# EAGLE design MUX (EAGLE 6.5.0)
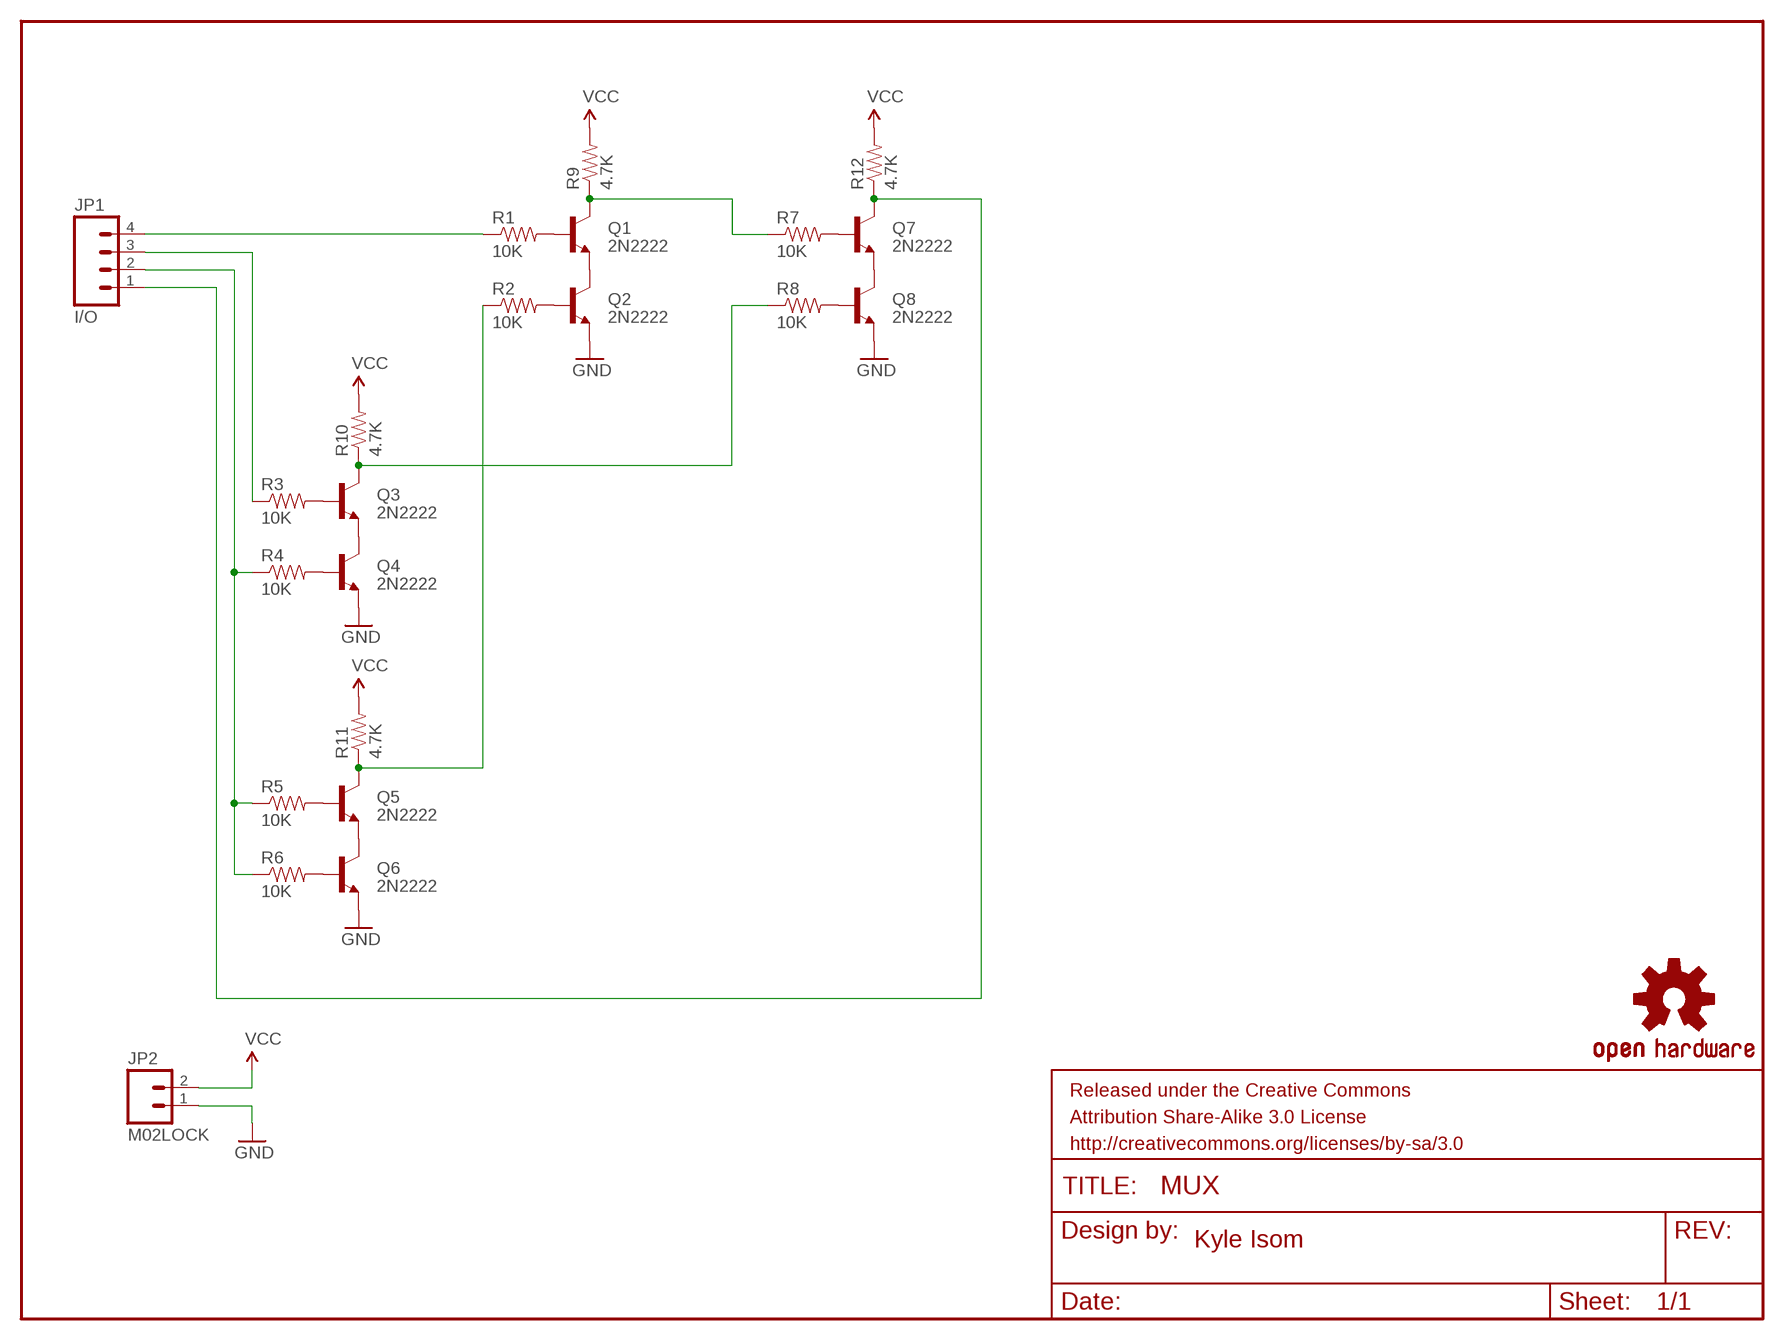
[diagram p0: schematic, sheet 1]

## Parts
FRAME1  FRAME-LETTER  [CREATIVE_COMMONS]
JP1  I/O  M04LOCK  [1X04_LOCK]
JP2  M02LOCK  [1X02_LOCK]
LOGO1  OSHW-LOGOS  [OSHW-LOGO-S]
Q1  2N2222  TRANSISTOR_NPNTO-92-AMMO  [TO-92-AMMO]
Q2  2N2222  TRANSISTOR_NPNTO-92-AMMO  [TO-92-AMMO]
Q3  2N2222  TRANSISTOR_NPNTO-92-AMMO  [TO-92-AMMO]
Q4  2N2222  TRANSISTOR_NPNTO-92-AMMO  [TO-92-AMMO]
Q5  2N2222  TRANSISTOR_NPNTO-92-AMMO  [TO-92-AMMO]
Q6  2N2222  TRANSISTOR_NPNTO-92-AMMO  [TO-92-AMMO]
Q7  2N2222  TRANSISTOR_NPNTO-92-AMMO  [TO-92-AMMO]
Q8  2N2222  TRANSISTOR_NPNTO-92-AMMO  [TO-92-AMMO]
R1  10K  RESISTORPTH-1/4W  [AXIAL-0.4]
R2  10K  RESISTORPTH-1/4W  [AXIAL-0.4]
R3  10K  RESISTORPTH-1/4W  [AXIAL-0.4]
R4  10K  RESISTORPTH-1/4W  [AXIAL-0.4]
R5  10K  RESISTORPTH-1/4W  [AXIAL-0.4]
R6  10K  RESISTORPTH-1/4W  [AXIAL-0.4]
R7  10K  RESISTORPTH-1/4W  [AXIAL-0.4]
R8  10K  RESISTORPTH-1/4W  [AXIAL-0.4]
R9  4.7K  RESISTORPTH-1/4W  [AXIAL-0.4]
R10  4.7K  RESISTORPTH-1/4W  [AXIAL-0.4]
R11  4.7K  RESISTORPTH-1/4W  [AXIAL-0.4]
R12  4.7K  RESISTORPTH-1/4W  [AXIAL-0.4]

## Nets
GND: JP2.1 Q2.1(E) Q4.1(E) Q6.1(E) Q8.1(E)
N$1: Q1.1(E) Q2.3(C)
N$2: Q3.1(E) Q4.3(C)
N$3: Q5.1(E) Q6.3(C)
N$4: Q1.2(B) R1.P$2
N$5: Q2.2(B) R2.P$2
N$6: Q3.2(B) R3.P$2
N$7: Q4.2(B) R4.P$2
N$8: Q5.2(B) R5.P$2
N$9: Q6.2(B) R6.P$2
N$10: Q7.1(E) Q8.3(C)
N$11: Q7.2(B) R7.P$2
N$12: Q8.2(B) R8.P$2
N$13: Q1.3(C) R7.P$1 R9.P$1
N$14: Q3.3(C) R8.P$1 R10.P$1
N$15: Q5.3(C) R2.P$1 R11.P$1
N$16: JP1.1 Q7.3(C) R12.P$1
N$17: JP1.4 R1.P$1
N$18: JP1.3 R3.P$1
N$19: JP1.2 R4.P$1 R5.P$1 R6.P$1
VCC: JP2.2 R9.P$2 R10.P$2 R11.P$2 R12.P$2

## Notes on the sheet
- Kyle Isom

## Library data of the parts
FRAME1 = SparkFun-Aesthetics:FRAME-LETTER: Schematic Frame Standard 8.5x11 US Letter frame
JP1 = SparkFun-Connectors:M04: Header 4 Standard 4-pin 0.1" header. Use with straight break away headers (SKU : PRT-00116), right angle break away headers (PRT-00553), swiss pins (PRT-00743), machine pins (PRT-00117), and female headers (PRT-00115). Molex polarized connector foot print use with SKU : PRT-08231 with associated crimp pins and housings. 1MM SMD Version SKU: PRT-10208
JP2 = SparkFun-Connectors:M02: Standard 2-pin 0.1" header. Use with - straight break away headers ( PRT-00116) - right angle break away headers (PRT-00553) - swiss pins (PRT-00743) - machine pins (PRT-00117) - female headers (PRT-00115) Molex polarized connector foot print use with: PRT-08233 with associated crimp pins and housings. 2.54_SCREWTERM for use with PRT-10571. 3.5mm Screw Terminal footprints for PRT-08084 5mm Screw Terminal footprints for use with PRT-08433
LOGO1 = SparkFun-Aesthetics:OSHW-LOGO: Open Source Hardware Logo This logo indicates the piece of hardware it is found on incorporates a OSHW license and/or adheres to the definition of open source hardware found here: http://freedomdefined.org/OSHW
Q1-Q8 = SparkFun-DiscreteSemi:TRANSISTOR_NPN: Generic NPN BJT MMBT2222A - TRANS-08049 (SOT-23, 1A 40V) MPSA42 - TRANS-09116 (SOT-23, 500mA 300V) MMBT5088LT1G - TRANS-11160 (SOT-23, 50 mA 30V)
R1-R12 = SparkFun-Passives:RESISTOR: Resistor Basic schematic elements and footprints for 0603, 1206, and PTH resistors.

## Board
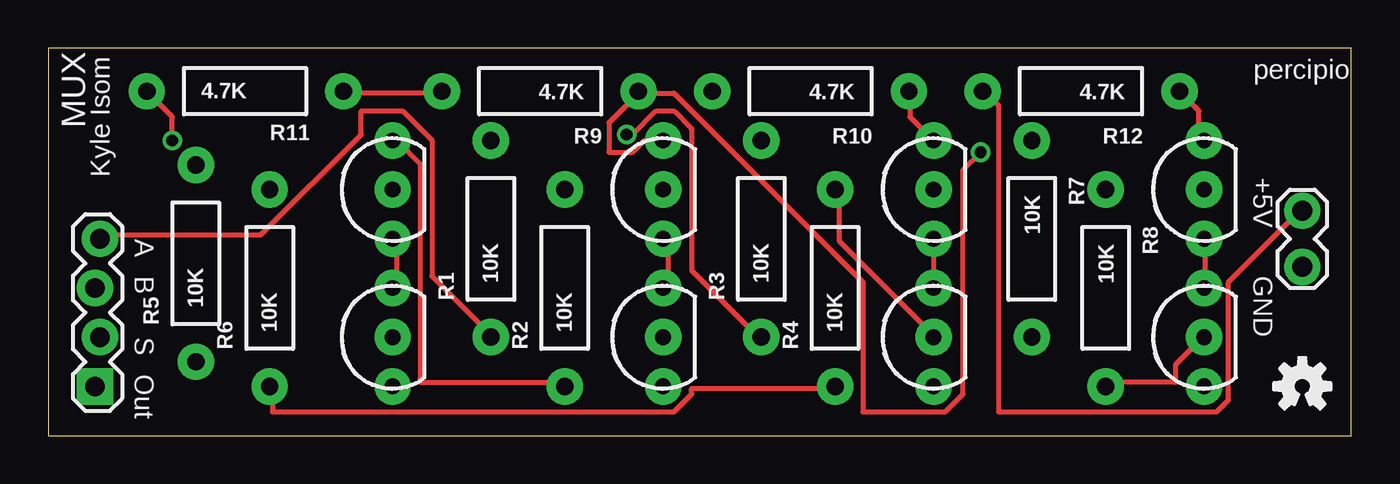
[diagram p1: board, top side]
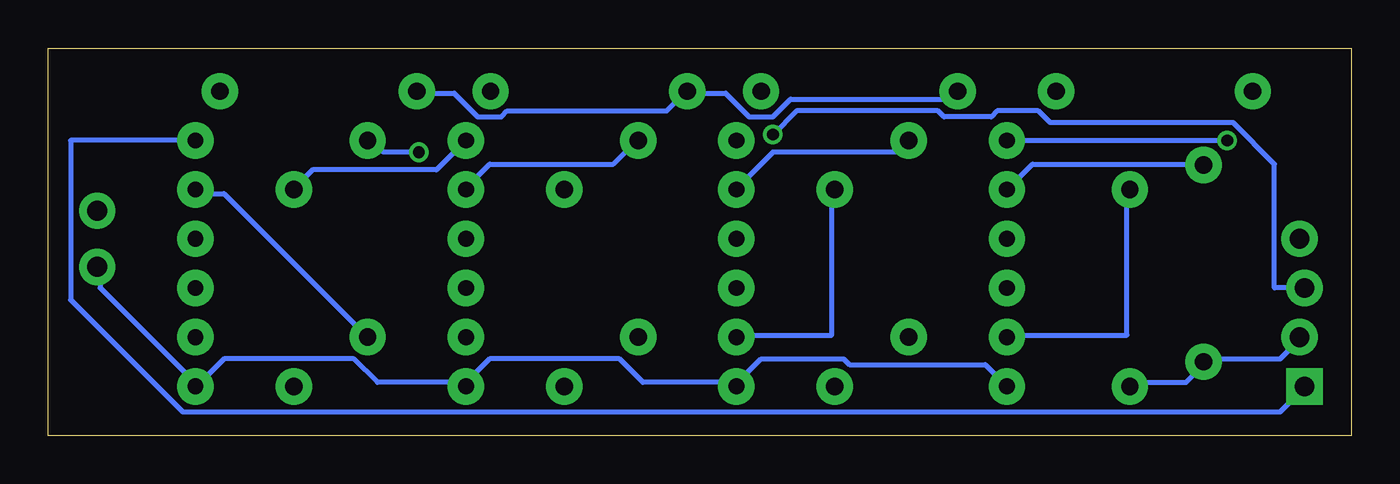
[diagram p2: board, bottom side, seen from below]

Size 67.29 x 19.99 mm. Coordinates in mm from the lower left corner, seen from the top.
Outline: 0,0 67.29,0 67.29,19.99 0,19.99 0,0
Copper layers (1*16): Top 0.035mm / dielectric 1.5mm / Bottom 0.035mm
Design rules "default": minimum track width 10mil, minimum drill 24mil, track to track 8mil, track to pad 8mil, pad to pad 8mil, via to via 8mil, smd to smd 8mil, copper to edge 40mil, drill to drill 8mil, minimum pad ring 10mil, minimum via ring 8mil, stop-mask expansion 4mil, vias tented up to drill 0mil, thermal gap 10mil

### Footprints (pad centres in the part's own frame; a part is rotated, then mirrored left to right if it is on the bottom)
1X04_LOCK = drill 1.016 pad 1.88 square: 1 0,0.127 | drill 1.016 pad 1.88: 2 2.54,-0.127; 3 5.08,0.127; 4 7.62,-0.127
1X02_LOCK = drill 1.016 pad 1.88: 1 -0.178,0; 2 2.718,0
TO-92-AMMO = drill 0.813 pad 1.88: 1 -2.54,0; 2 0,0; 3 2.54,0
AXIAL-0.4 = drill 0.9 pad 1.88: P$1 -5.08,0; P$2 5.08,0

### Placement (x,y rotation side)
FRAME1  11.43,-8.89 0 top  (outside the outline)
JP1  2.54,2.54 90 top
JP2  64.77,8.89 90 top
LOGO1  64.77,2.54 0 top
Q1  31.75,12.7 90 top
Q2  31.75,5.08 90 top
Q3  45.72,12.7 90 top
Q4  45.72,5.08 90 top
Q5  17.78,12.7 90 top
Q6  17.78,5.08 90 top
Q7  59.69,12.7 90 top
Q8  59.69,5.08 90 top
R1  22.86,10.16 90 top
R2  26.67,7.62 90 top
R3  36.83,10.16 90 top
R4  40.64,7.62 90 top
R5  7.62,8.89 90 top
R6  11.43,7.62 90 top
R7  50.8,10.16 270 top
R8  54.61,7.62 270 top
R9  25.4,17.78 180 top
R10  39.37,17.78 180 top
R11  10.16,17.78 0 top
R12  53.34,17.78 180 top

### Tracks (layer width: path | path; a pad name or v marks a point on that pad's centre or on a via)
GND
  Bottom 0.254: JP2.1 64.62,8.53 64.62,7.62 59.74,2.74 Q8.1 59.44,2.74 58.22,3.96 51.51,3.96 50.29,2.74 45.72,2.74 | Q6.1 18.9,3.66 25.91,3.66 26.21,3.96 30.48,3.96 31.7,2.74 Q2.1 32,2.74 36.58,2.74 37.8,3.96 44.5,3.96 45.72,2.74 | 45.72,2.74 Q4.1
N$1
  Top 0.254: Q2.3 32,7.62 32,10.06 Q1.1
N$2
  Top 0.254: Q3.1 Q4.3
N$3
  Top 0.254: Q6.3 17.98,7.62 17.98,10.06 Q5.1
N$4
  Bottom 0.254: R1.P$2 23.47,14.63 29.87,14.63 31.7,12.8 Q1.2
N$5
  Bottom 0.254: R2.P$2 26.82,12.5 26.82,5.18 31.7,5.18 Q2.2
N$6
  Bottom 0.254: R3.P$2 36.88,15.24 38.1,14.02 44.5,14.02 45.72,12.8 Q3.2
N$7
  Top 0.254: Q4.2 45.72,5.18 40.84,10.06 40.84,12.5 R4.P$2
N$8
  Bottom 0.254: Q5.2 16.46,14.02 7.62,14.02 R5.P$2
N$9
  Bottom 0.254: R6.P$2 11.58,12.5 11.58,5.18 17.68,5.18 Q6.2
N$10
  Top 0.254: Q8.3 59.74,7.62 59.74,10.06 Q7.1
N$11
  Bottom 0.254: R7.P$2 58.22,12.5 59.44,12.5 Q7.2
N$12
  Top 0.254: R8.P$2 54.86,2.74 58.22,2.74 58.22,3.66 59.44,4.88 Q8.2
N$13  (via drill 0.61)
  Top 0.254: Q1.3 30.79,15.24 30.18,14.63 28.96,14.63 28.96,16.15 30.48,17.68 | v48.16,14.63 47.24,13.72 47.24,2.13 46.33,1.22 42.06,1.22 42.06,7.92 32.31,17.68 30.48,17.68 | 30.48,17.68 R9.P$1
  Bottom 0.254: v48.16,14.63 49.99,14.63 50.6,15.24 R7.P$1
N$14
  Top 0.254: Q3.3 44.5,16.46 44.5,17.68 R10.P$1
  Bottom 0.254: Q3.3 47.24,13.72 53.65,13.72 54.56,12.8 R8.P$1
N$15  (via drill 0.61)
  Top 0.254: R11.P$1 6.4,16.46 v6.4,15.24 | R2.P$1 26.52,2.74 19.2,2.74 19.2,14.02 17.98,15.24 Q5.3
  Bottom 0.254: Q5.3 v6.4,15.24
N$16
  Top 0.254: R12.P$1 59.44,16.76 59.44,15.24 Q7.3
  Bottom 0.254: Q7.3 66.14,15.24 66.14,7.01 60.35,1.22 3.66,1.22 2.44,2.44 JP1.1
N$17
  Top 0.254: R1.P$1 22.86,5.18 19.81,8.23 19.81,15.24 18.29,16.76 16.15,16.76 16.15,15.54 10.97,10.36 2.74,10.36 JP1.4
N$18  (via drill 0.61)
  Top 0.254: v29.87,15.54 30.18,15.54 31.39,16.76 32.31,16.76 33.22,15.85 33.22,8.53 36.58,5.18 R3.P$1
  Bottom 0.254: v29.87,15.54 28.65,16.76 21.34,16.76 21.03,16.46 18.59,16.46 18.29,16.76 16.15,16.76 15.54,16.15 6.1,16.15 3.96,14.02 3.96,7.62 JP1.3
N$19
  Top 0.254: R4.P$1 40.54,2.44 33.22,2.44 33.22,2.13 32.31,1.22 11.58,1.22 11.58,2.44 R6.P$1
  Bottom 0.254: R6.P$1 11.28,2.74 8.53,2.74 7.62,3.66 R5.P$1 7.62,3.96 3.66,3.96 2.74,4.88 JP1.2
VCC
  Top 0.254: R11.P$2 15.24,17.68 20.12,17.68 R9.P$2 | JP2.2 64.62,11.58 60.96,7.92 60.96,1.83 60.35,1.22 49.07,1.22 49.07,17.07 48.46,17.68 R12.P$2
  Bottom 0.254: R12.P$2 48.16,17.68 46.33,17.68 45.11,16.46 43.89,16.46 43.59,16.76 35.36,16.76 34.44,17.68 R10.P$2 34.14,17.68 32.31,17.68 31.09,16.46 29.87,16.46 28.96,17.37 20.73,17.37 R9.P$2

### Text on the board
tPlace: percipio | MUX | Kyle Isom | +5V | A | B | GND | S | Out